# Altium schematic sheet MCU.SchDoc: Bison-Board
size A2; DrawnBy: mzy2364; Revision: V1.4
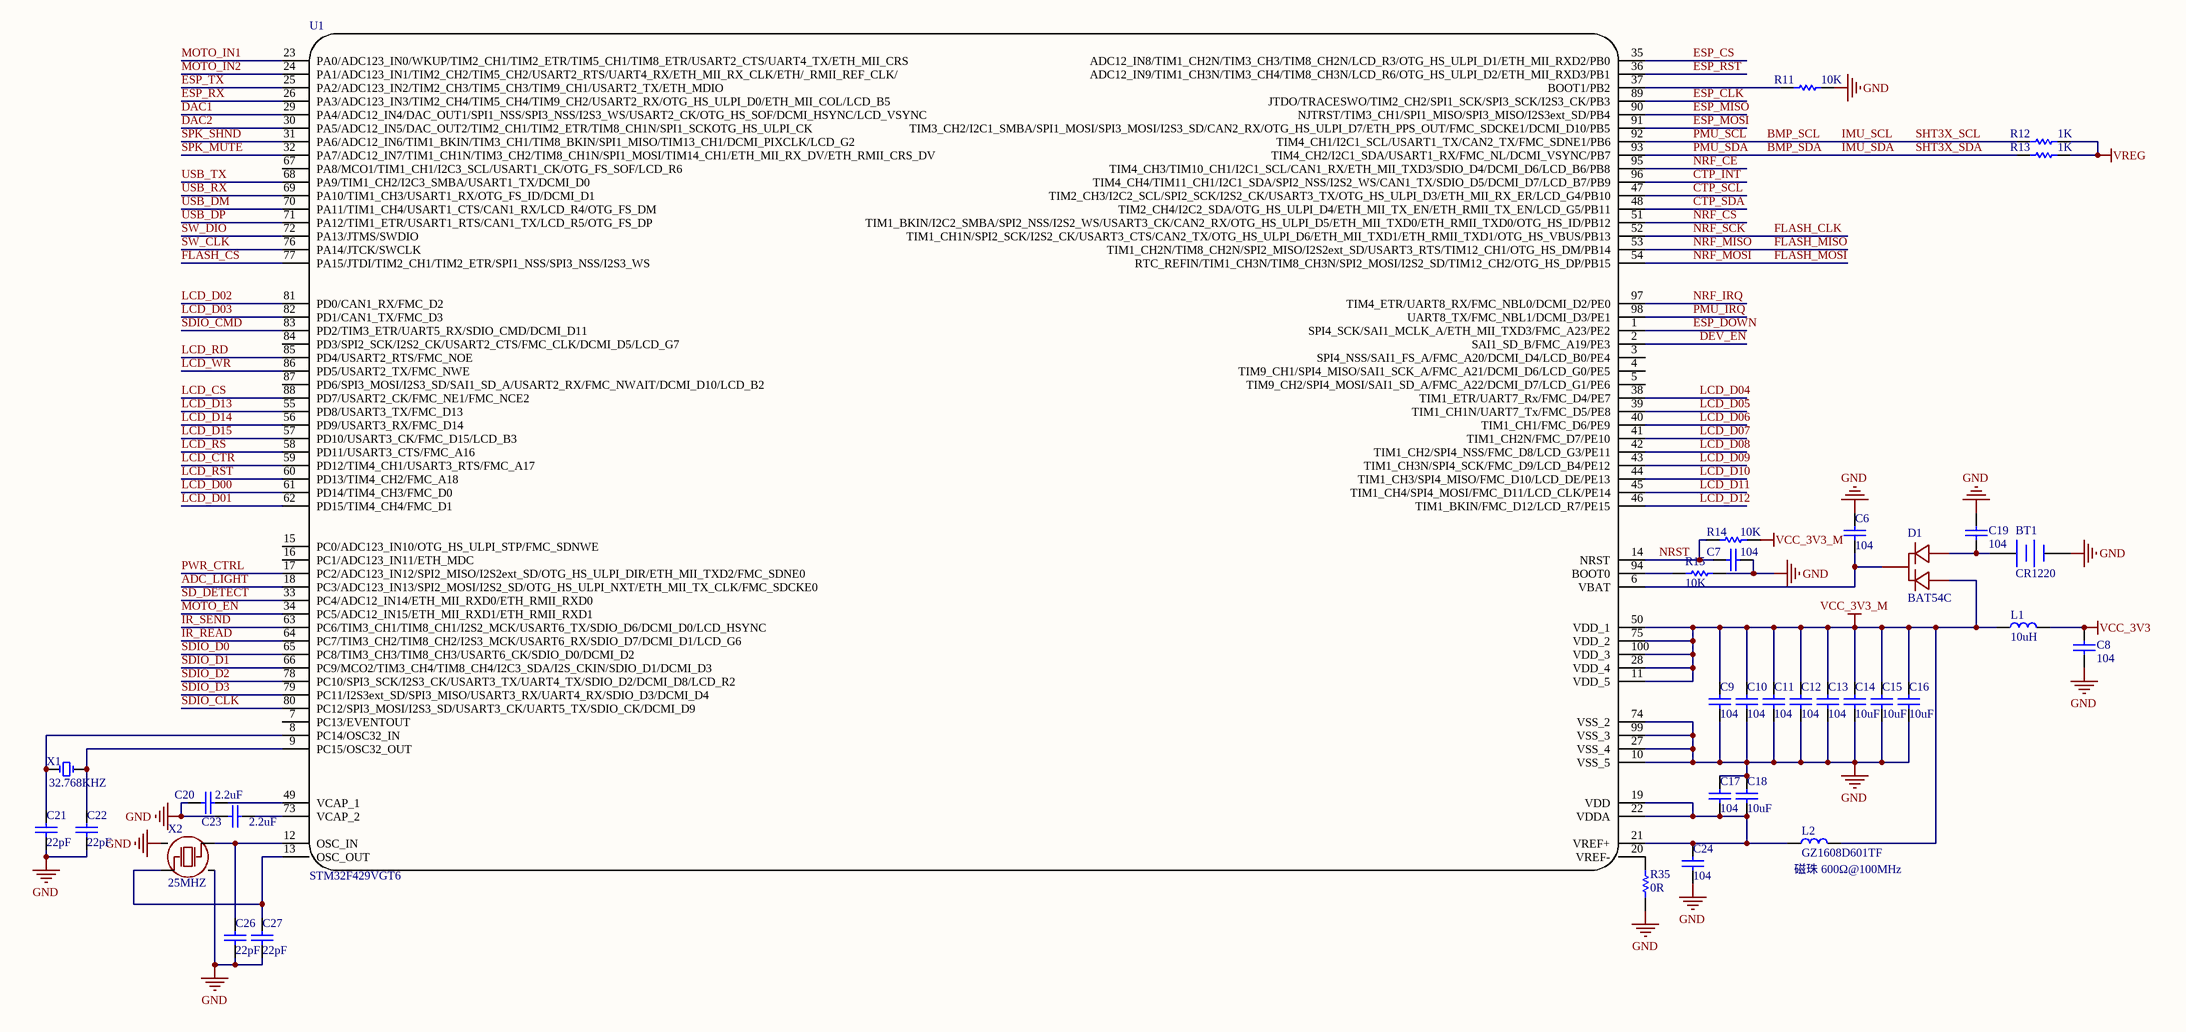
[diagram p0: MCU.SchDoc]

## Parts
BT1  CR1220  [CR1220-2]
C6  104  [C 0603]
C7  104  [C 0603]
C8  104  [C 0603]
C9  104  [C 0603]
C10  104  [C 0603]
C11  104  [C 0603]
C12  104  [C 0603]
C13  104  [C 0603]
C14  10uF  [C 0603]
C15  10uF  [C 0603]
C16  10uF  [C 0603]
C17  104  [C 0603]
C18  10uF  [C 0603]
C19  104  [C 0603]
C20  2.2uF  [C 0603]
C21  22pF  [C 0603]
C22  22pF  [C 0603]
C23  2.2uF  [C 0603]
C24  104  [C 0603]
C26  22pF  [C 0603]
C27  22pF  [C 0603]
D1  BAT54C  [SOT-23]
L1  10uH  [L 0603]
L2  GZ1608D601TF  [L 0603]
R11  10K  [R 0603]
R12  1K  [R 0603]
R13  1K  [R 0603]
R14  10K  [R 0603]
R15  10K  [R 0603]
R35  0R  [R 0603]
U1  STM32F429VGT6  [LQFP100]
X1  32.768KHZ  [XTAL-3215]
X2  25MHZ  [SMD-3225]

## Nets
GND: BT1.2(-) C6.2 C7.1 C8.1 C9.1 C10.1 C11.1 C12.1 C13.1 C14.1 C15.1 C16.1 C17.2 C18.2 C19.1 C20.1 C21.1 C22.1 C23.1 C24.1 C26.1 C27.1 R11.2 R15.2 R35.1 U1.10(VSS_5) U1.27(VSS_4) U1.74(VSS_2) U1.99(VSS_3) X2.2 X2.4
VCC_3V3: C8.2 L1.2
VCC_3V3_M: C9.2 C10.2 C11.2 C12.2 C13.2 C14.2 C15.2 C16.2 D1.1(A) L1.1 L2.2 R14.1 U1.11(VDD_5) U1.28(VDD_4) U1.50(VDD_1) U1.75(VDD_2) U1.100(VDD_3)
VREG: R12.2 R13.2
ADC_LIGHT: U1.18(PC3/ADC123_IN13/SPI2_MOSI/I2S2_SD/OTG_HS_ULPI_NXT/ETH_MII_TX_CLK/FMC_SDCKE0)
BMP_SCL: R12.1 U1.92(TIM4_CH1/I2C1_SCL/USART1_TX/CAN2_TX/FMC_SDNE1/PB6)  [also labelled IMU_SCL, PMU_SCL, SHT3X_SCL]
BMP_SDA: R13.1 U1.93(TIM4_CH2/I2C1_SDA/USART1_RX/FMC_NL/DCMI_VSYNC/PB7)  [also labelled IMU_SDA, PMU_SDA, SHT3X_SDA]
CTP_INT: U1.96(TIM4_CH4/TIM11_CH1/I2C1_SDA/SPI2_NSS/I2S2_WS/CAN1_TX/SDIO_D5/DCMI_D7/LCD_B7/PB9)
CTP_SCL: U1.47(TIM2_CH3/I2C2_SCL/SPI2_SCK/I2S2_CK/USART3_TX/OTG_HS_ULPI_D3/ETH_MII_RX_ER/LCD_G4/PB10)
CTP_SDA: U1.48(TIM2_CH4/I2C2_SDA/OTG_HS_ULPI_D4/ETH_MII_TX_EN/ETH_RMII_TX_EN/LCD_G5/PB11)
DAC1: U1.29(PA4/ADC12_IN4/DAC_OUT1/SPI1_NSS/SPI3_NSS/I2S3_WS/USART2_CK/OTG_HS_SOF/DCMI_HSYNC/LCD_VSYNC)
DAC2: U1.30(PA5/ADC12_IN5/DAC_OUT2/TIM2_CH1/TIM2_ETR/TIM8_CH1N/SPI1_SCKOTG_HS_ULPI_CK)
DEV_EN: U1.2(SAI1_SD_B/FMC_A19/PE3)
ESP_CLK: U1.89(JTDO/TRACESWO/TIM2_CH2/SPI1_SCK/SPI3_SCK/I2S3_CK/PB3)
ESP_CS: U1.35(ADC12_IN8/TIM1_CH2N/TIM3_CH3/TIM8_CH2N/LCD_R3/OTG_HS_ULPI_D1/ETH_MII_RXD2/PB0)
ESP_DOWN: U1.1(SPI4_SCK/SAI1_MCLK_A/ETH_MII_TXD3/FMC_A23/PE2)
ESP_MISO: U1.90(NJTRST/TIM3_CH1/SPI1_MISO/SPI3_MISO/I2S3ext_SD/PB4)
ESP_MOSI: U1.91(TIM3_CH2/I2C1_SMBA/SPI1_MOSI/SPI3_MOSI/I2S3_SD/CAN2_RX/OTG_HS_ULPI_D7/ETH_PPS_OUT/FMC_SDCKE1/DCMI_D10/PB5)
ESP_RST: U1.36(ADC12_IN9/TIM1_CH3N/TIM3_CH4/TIM8_CH3N/LCD_R6/OTG_HS_ULPI_D2/ETH_MII_RXD3/PB1)
ESP_RX: U1.26(PA3/ADC123_IN3/TIM2_CH4/TIM5_CH4/TIM9_CH2/USART2_RX/OTG_HS_ULPI_D0/ETH_MII_COL/LCD_B5)
ESP_TX: U1.25(PA2/ADC123_IN2/TIM2_CH3/TIM5_CH3/TIM9_CH1/USART2_TX/ETH_MDIO)
FLASH_CLK: U1.52(TIM1_CH1N/SPI2_SCK/I2S2_CK/USART3_CTS/CAN2_TX/OTG_HS_ULPI_D6/ETH_MII_TXD1/ETH_RMII_TXD1/OTG_HS_VBUS/PB13)  [also labelled NRF_SCK]
FLASH_CS: U1.77(PA15/JTDI/TIM2_CH1/TIM2_ETR/SPI1_NSS/SPI3_NSS/I2S3_WS)
FLASH_MISO: U1.53(TIM1_CH2N/TIM8_CH2N/SPI2_MISO/I2S2ext_SD/USART3_RTS/TIM12_CH1/OTG_HS_DM/PB14)  [also labelled NRF_MISO]
FLASH_MOSI: U1.54(RTC_REFIN/TIM1_CH3N/TIM8_CH3N/SPI2_MOSI/I2S2_SD/TIM12_CH2/OTG_HS_DP/PB15)  [also labelled NRF_MOSI]
IR_READ: U1.64(PC7/TIM3_CH2/TIM8_CH2/I2S3_MCK/USART6_RX/SDIO_D7/DCMI_D1/LCD_G6)
IR_SEND: U1.63(PC6/TIM3_CH1/TIM8_CH1/I2S2_MCK/USART6_TX/SDIO_D6/DCMI_D0/LCD_HSYNC)
LCD_CS: U1.88(PD7/USART2_CK/FMC_NE1/FMC_NCE2)
LCD_CTR: U1.59(PD12/TIM4_CH1/USART3_RTS/FMC_A17)
LCD_D00: U1.61(PD14/TIM4_CH3/FMC_D0)
LCD_D01: U1.62(PD15/TIM4_CH4/FMC_D1)
LCD_D02: U1.81(PD0/CAN1_RX/FMC_D2)
LCD_D03: U1.82(PD1/CAN1_TX/FMC_D3)
LCD_D04: U1.38(TIM1_ETR/UART7_Rx/FMC_D4/PE7)
LCD_D05: U1.39(TIM1_CH1N/UART7_Tx/FMC_D5/PE8)
LCD_D06: U1.40(TIM1_CH1/FMC_D6/PE9)
LCD_D07: U1.41(TIM1_CH2N/FMC_D7/PE10)
LCD_D08: U1.42(TIM1_CH2/SPI4_NSS/FMC_D8/LCD_G3/PE11)
LCD_D09: U1.43(TIM1_CH3N/SPI4_SCK/FMC_D9/LCD_B4/PE12)
LCD_D10: U1.44(TIM1_CH3/SPI4_MISO/FMC_D10/LCD_DE/PE13)
LCD_D11: U1.45(TIM1_CH4/SPI4_MOSI/FMC_D11/LCD_CLK/PE14)
LCD_D12: U1.46(TIM1_BKIN/FMC_D12/LCD_R7/PE15)
LCD_D13: U1.55(PD8/USART3_TX/FMC_D13)
LCD_D14: U1.56(PD9/USART3_RX/FMC_D14)
LCD_D15: U1.57(PD10/USART3_CK/FMC_D15/LCD_B3)
LCD_RD: U1.85(PD4/USART2_RTS/FMC_NOE)
LCD_RS: U1.58(PD11/USART3_CTS/FMC_A16)
LCD_RST: U1.60(PD13/TIM4_CH2/FMC_A18)
LCD_WR: U1.86(PD5/USART2_TX/FMC_NWE)
MOTO_EN: U1.34(PC5/ADC12_IN15/ETH_MII_RXD1/ETH_RMII_RXD1)
MOTO_IN1: U1.23(PA0/ADC123_IN0/WKUP/TIM2_CH1/TIM2_ETR/TIM5_CH1/TIM8_ETR/USART2_CTS/UART4_TX/ETH_MII_CRS)
MOTO_IN2: U1.24(PA1/ADC123_IN1/TIM2_CH2/TIM5_CH2/USART2_RTS/UART4_RX/ETH_MII_RX_CLK/ETH/_RMII_REF_CLK/)
NRF_CE: U1.95(TIM4_CH3/TIM10_CH1/I2C1_SCL/CAN1_RX/ETH_MII_TXD3/SDIO_D4/DCMI_D6/LCD_B6/PB8)
NRF_CS: U1.51(TIM1_BKIN/I2C2_SMBA/SPI2_NSS/I2S2_WS/USART3_CK/CAN2_RX/OTG_HS_ULPI_D5/ETH_MII_TXD0/ETH_RMII_TXD0/OTG_HS_ID/PB12)
NRF_IRQ: U1.97(TIM4_ETR/UART8_RX/FMC_NBL0/DCMI_D2/PE0)
NRST: C7.2 R14.2 U1.14(NRST)
PMU_IRQ: U1.98(UART8_TX/FMC_NBL1/DCMI_D3/PE1)
PWR_CTRL: U1.17(PC2/ADC123_IN12/SPI2_MISO/I2S2ext_SD/OTG_HS_ULPI_DIR/ETH_MII_TXD2/FMC_SDNE0)
SD_DETECT: U1.33(PC4/ADC12_IN14/ETH_MII_RXD0/ETH_RMII_RXD0)
SDIO_CLK: U1.80(PC12/SPI3_MOSI/I2S3_SD/USART3_CK/UART5_TX/SDIO_CK/DCMI_D9)
SDIO_CMD: U1.83(PD2/TIM3_ETR/UART5_RX/SDIO_CMD/DCMI_D11)
SDIO_D0: U1.65(PC8/TIM3_CH3/TIM8_CH3/USART6_CK/SDIO_D0/DCMI_D2)
SDIO_D1: U1.66(PC9/MCO2/TIM3_CH4/TIM8_CH4/I2C3_SDA/I2S_CKIN/SDIO_D1/DCMI_D3)
SDIO_D2: U1.78(PC10/SPI3_SCK/I2S3_CK/USART3_TX/UART4_TX/SDIO_D2/DCMI_D8/LCD_R2)
SDIO_D3: U1.79(PC11/I2S3ext_SD/SPI3_MISO/USART3_RX/UART4_RX/SDIO_D3/DCMI_D4)
SPK_MUTE: U1.32(PA7/ADC12_IN7/TIM1_CH1N/TIM3_CH2/TIM8_CH1N/SPI1_MOSI/TIM14_CH1/ETH_MII_RX_DV/ETH_RMII_CRS_DV)
SPK_SHND: U1.31(PA6/ADC12_IN6/TIM1_BKIN/TIM3_CH1/TIM8_BKIN/SPI1_MISO/TIM13_CH1/DCMI_PIXCLK/LCD_G2)
SW_CLK: U1.76(PA14/JTCK/SWCLK)
SW_DIO: U1.72(PA13/JTMS/SWDIO)
USB_DM: U1.70(PA11/TIM1_CH4/USART1_CTS/CAN1_RX/LCD_R4/OTG_FS_DM)
USB_DP: U1.71(PA12/TIM1_ETR/USART1_RTS/CAN1_TX/LCD_R5/OTG_FS_DP)
USB_RX: U1.69(PA10/TIM1_CH3/USART1_RX/OTG_FS_ID/DCMI_D1)
USB_TX: U1.68(PA9/TIM1_CH2/I2C3_SMBA/USART1_TX/DCMI_D0)
NetBT1_1: BT1.1(+) C19.2 D1.2(A)
NetC6_1: C6.1 D1.3(C) U1.6(VBAT)
NetC17_1: C17.1 C18.1 C24.2 L2.1 U1.19(VDD) U1.21(VREF+) U1.22(VDDA)
NetC20_2: C20.2 U1.49(VCAP_1)
NetC21_2: C21.2 U1.8(PC14/OSC32_IN) X1.1
NetC22_2: C22.2 U1.9(PC15/OSC32_OUT) X1.2
NetC23_2: C23.2 U1.73(VCAP_2)
NetC26_2: C26.2 U1.12(OSC_IN) X2.3
NetC27_2: C27.2 U1.13(OSC_OUT) X2.1
NetR11_1: R11.1 U1.37(BOOT1/PB2)
NetR15_1: R15.1 U1.94(BOOT0)
NetR35_2: R35.2 U1.20(VREF-)

Not connected (* = marked no-connect by the designer): U1 3(SPI4_NSS/SAI1_FS_A/FMC_A20/DCMI_D4/LCD_B0/PE4) 4(TIM9_CH1/SPI4_MISO/SAI1_SCK_A/FMC_A21/DCMI_D6/LCD_G0/PE5) 5(TIM9_CH2/SPI4_MOSI/SAI1_SD_A/FMC_A22/DCMI_D7/LCD_G1/PE6) 7(PC13/EVENTOUT) 15(PC0/ADC123_IN10/OTG_HS_ULPI_STP/FMC_SDNWE) 16(PC1/ADC123_IN11/ETH_MDC) 67(PA8/MCO1/TIM1_CH1/I2C3_SCL/USART1_CK/OTG_FS_SOF/LCD_R6) 84(PD3/SPI2_SCK/I2S2_CK/USART2_CTS/FMC_CLK/DCMI_D5/LCD_G7) 87(PD6/SPI3_MOSI/I2S3_SD/SAI1_SD_A/USART2_RX/FMC_NWAIT/DCMI_D10/LCD_B2)

## Notes on the sheet
- (near L2) 磁珠 600Ω@100MHz

## Library data of the parts
BT1 = Battery: Multicell Battery; Published: 24-Mar-1999; LatestRevisionDate: 17-Jul-2002; LatestRevisionNote: Re-released for DXP Platform.; PackageReference: BAT-2; Publisher: Altium Limited; PackageDescription: Battery; 2 Leads
C6-C24 C26 C27 = CAP
L1 L2 = INDUCTOR
R11-R15 R35 = RES
X1 = XTAL-2P
X2 = XTAL-4P